# Altium schematic sheet SCH_WINGLET_ADSB.SchDoc: Winglet ADSB Receiver
size B; DrawnBy: HCAdam; Organization: Aerospace Village; DocumentNumber: WINGLET; Revision: A; SheetNumber: 8; SheetTotal: 10
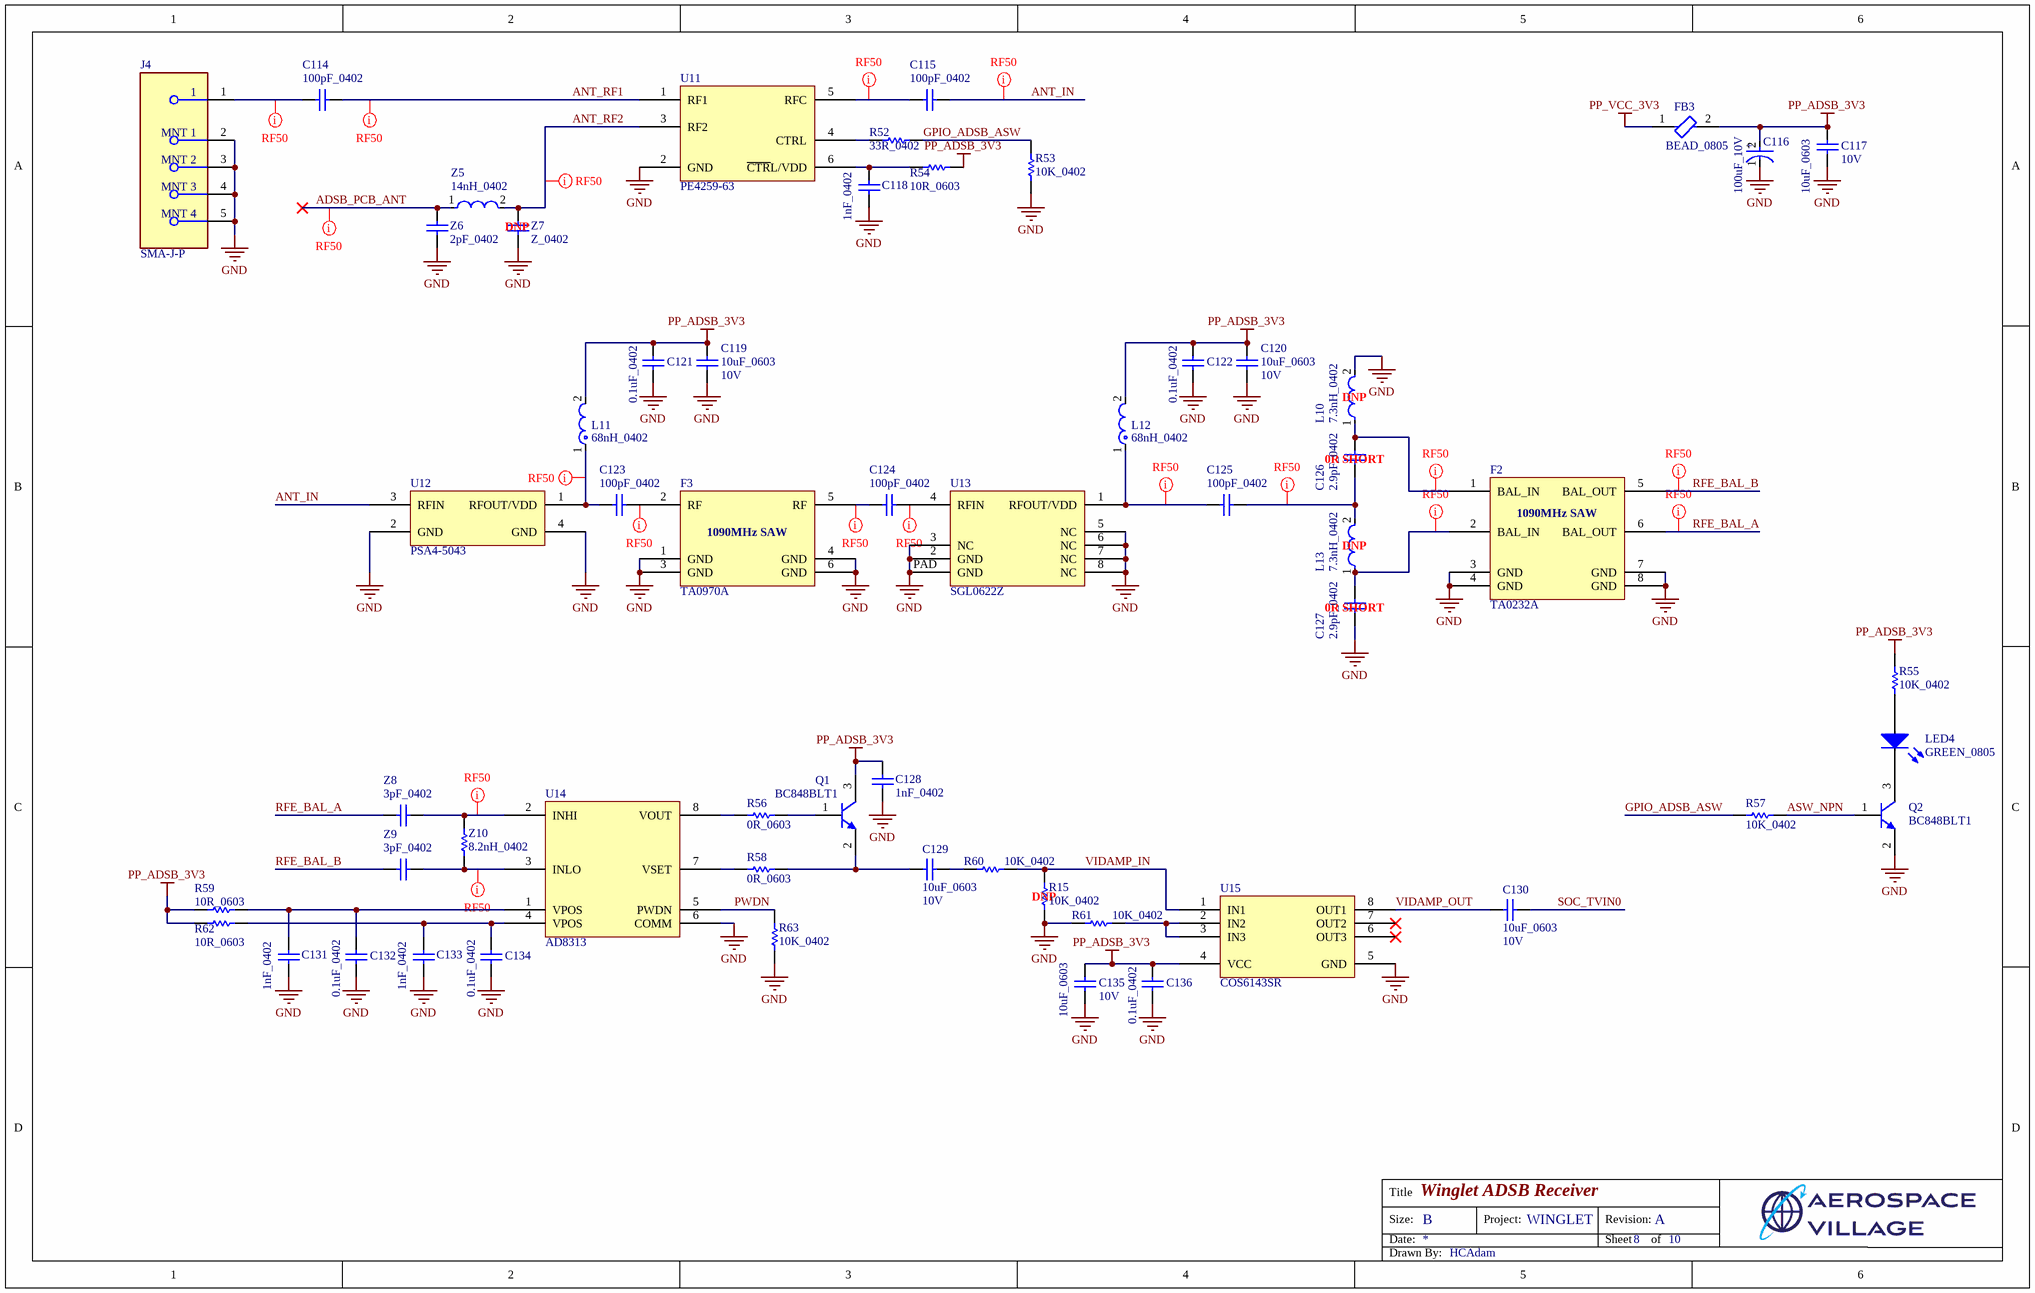
[diagram p0: SCH_WINGLET_ADSB.SchDoc]

## Parts
C114  100pF_0402  [CAPC1005X55X25NL05T10]
C115  100pF_0402  [CAPC1005X55X25NL05T10]
C116  100uF_10V  [FP-TAJB-MFG]
C117  10uF_0603  Voltage Rating: 10V  [CAPC1609X100X15NL20]
C118  1nF_0402  [CAPC1005X56X25NL10T15]
C119  10uF_0603  Voltage Rating: 10V  [CAPC1609X100X15NL20]
C120  10uF_0603  Voltage Rating: 10V  [CAPC1609X100X15NL20]
C121  0.1uF_0402  [CAPC1005X56X25NL10T15]
C122  0.1uF_0402  [CAPC1005X56X25NL10T15]
C123  100pF_0402  [CAPC1005X55X25NL05T10]
C124  100pF_0402  [CAPC1005X55X25NL05T10]
C125  100pF_0402  [CAPC1005X55X25NL05T10]
C126  2.9pF_0402  [CAPC1006X50X20NL10T10]
C127  2.9pF_0402  [CAPC1006X50X20NL10T10]
C128  1nF_0402  [CAPC1005X56X25NL10T15]
C129  10uF_0603  Voltage Rating: 10V  [CAPC1609X100X15NL20]
C130  10uF_0603  Voltage Rating: 10V  [CAPC1609X100X15NL20]
C131  1nF_0402  [CAPC1005X56X25NL10T15]
C132  0.1uF_0402  [CAPC1005X56X25NL10T15]
C133  1nF_0402  [CAPC1005X56X25NL10T15]
C134  0.1uF_0402  [CAPC1005X56X25NL10T15]
C135  10uF_0603  Voltage Rating: 10V  [CAPC1609X100X15NL20]
C136  0.1uF_0402  [CAPC1005X56X25NL10T15]
F2  TA0232A  [LCCS127P380X380X125-8N]
F3  TA0970A  [LCCS127P380X380X125-6N]
FB3  BEAD_0805  [FP-BLM21-0_2-t0_85-e0_5-IPC_B]
J4  SMA-J-P  [FP-SMA-J-P-H-ST-EM1-MFG]
L10  7.3nH_0402  [FP-LQW15AN_00-W0_6-0_1-MFG]
L11  68nH_0402  [FP-LQG15HH_02-MFG]
L12  68nH_0402  [FP-LQG15HH_02-MFG]
L13  7.3nH_0402  [FP-LQW15AN_00-W0_6-0_1-MFG]
LED4  GREEN_0805  [0805_A]
Q1  BC848BLT1  [ONSC-SOT-23-3-318-08_V]
Q2  BC848BLT1  [ONSC-SOT-23-3-318-08_V]
R15  10K_0402  [RESC1005X40X25NL05T05]
R52  33R_0402  [RESC1005X40X25NL05T05]
R53  10K_0402  [RESC1005X40X25NL05T05]
R54  10R_0603  [RESC1608X55X25NL10T15]
R55  10K_0402  [RESC1005X40X25NL05T05]
R56  0R_0603  [RESC1608X55X25LL10T15]
R57  10K_0402  [RESC1005X40X25NL05T05]
R58  0R_0603  [RESC1608X55X25LL10T15]
R59  10R_0603  [RESC1608X55X25NL10T15]
R60  10K_0402  [RESC1005X40X25NL05T05]
R61  10K_0402  [RESC1005X40X25NL05T05]
R62  10R_0603  [RESC1608X55X25NL10T15]
R63  10K_0402  [RESC1005X40X25NL05T05]
U11  PE4259-63  [SOT65P210X100-6N]
U12  PSA4-5043  [SOT343P210X110-4N-MMM]
U13  SGL0622Z  [SON50P200X90_HS-9N]
U14  AD8313  [TSOP65P490X110-8N-AD8313]
U15  COS6143SR  [SOP127P600X175-8N]
Z5  14nH_0402  [FP-LQW15AN_80-MFG]
Z6  2pF_0402  [CAPC1005X55X25NL05T10]
Z7  Z_0402  [CAPC1005X55X25NL05T10]
Z8  3pF_0402  [CAPC1006X50X20NL10T10]
Z9  3pF_0402  [CAPC1006X50X20NL10T10]
Z10  8.2nH_0402  [RESC1005X40X25NL05T05]

## Nets
GND: C116.1(C) C117.1 C118.1 C119.1 C120.1 C121.1 C122.1 C127.1 C128.1 C131.1 C132.1 C133.1 C134.1 C135.1 C136.1 F2.3(GND) F2.4(GND) F2.7(GND) F2.8(GND) F3.1(GND) F3.3(GND) F3.4(GND) F3.6(GND) J4.2(MNT_1) J4.3(MNT_2) J4.4(MNT_3) J4.5(MNT_4) L10.2 Q2.2(E) R15.1 R53.1 R61.1 R63.1 U11.2(GND) U12.2(GND) U12.4(GND) U13.2(GND) U13.3(NC) U13.5(NC) U13.6(NC) U13.7(NC) U13.8(NC) U13.PAD(GND) U14.6(COMM) U15.5(GND) Z6.1 Z7.1
PP_ADSB_3V3: C116.2(A) C117.2 C119.2 C120.2 C121.2 C122.2 C128.2 C135.2 C136.2 FB3.2 L11.2 L12.2 Q1.3(C) R54.2 R55.2 R59.1 R62.1 U15.4(VCC)
PP_VCC_3V3: FB3.1
ADSB_PCB_ANT: Z5.1 Z6.2
ANT_IN: C115.2 U12.3(RFIN)
ANT_RF1: C114.2 U11.1(RF1)
ANT_RF2: U11.3(RF2) Z5.2 Z7.2
ASW_NPN: Q2.1(B) R57.1
GPIO_ADSB_ASW: R52.2 R53.2 R57.2
PWDN: R63.2 U14.5(PWDN)
RFE_BAL_A: F2.6(BAL_OUT) Z8.2
RFE_BAL_B: F2.5(BAL_OUT) Z9.2
SOC_TVIN0: C130.1
VIDAMP_IN: R15.2 R60.2 U15.1(IN1)
VIDAMP_OUT: C130.2 U15.8(OUT1)
NetC114_1: C114.1 J4.1
NetC115_1: C115.1 U11.5(RFC)
NetC118_2: C118.2 R54.1 U11.6(~{CTR}L/VDD)
NetC123_1: C123.1 L11.1 U12.1(RFOUT/VDD)
NetC123_2: C123.2 F3.2(RF)
NetC124_1: C124.1 F3.5(RF)
NetC124_2: C124.2 U13.4(RFIN)
NetC125_1: C125.1 L12.1 U13.1(RFOUT/VDD)
NetC125_2: C125.2 C126.1 L13.2
NetC126_2: C126.2 F2.1(BAL_IN) L10.1
NetC127_2: C127.2 F2.2(BAL_IN) L13.1
NetC129_1: C129.1 R60.1
NetC129_2: C129.2 Q1.2(E) R58.1
NetC131_2: C131.2 C132.2 R59.2 U14.1(VPOS)
NetC133_2: C133.2 C134.2 R62.2 U14.4(VPOS)
NetLED4_1: LED4.1(K) Q2.3(C)
NetLED4_2: LED4.2(A) R55.1
NetQ1_1: Q1.1(B) R56.1
NetR52_1: R52.1 U11.4(CTRL)
NetR56_2: R56.2 U14.8(VOUT)
NetR58_2: R58.2 U14.7(VSET)
NetR61_2: R61.2 U15.2(IN2) U15.3(IN3)
NetU14_2: U14.2(INHI) Z8.1 Z10.2
NetU14_3: U14.3(INLO) Z9.1 Z10.1

Not connected (* = marked no-connect by the designer): U15 6(OUT3)* 7(OUT2)*

## Layout directives
net class RF_50Z: ADSB_PCB_ANT, ANT_IN, ANT_RF1, ANT_RF2, NetC114_1, NetC115_1, NetC123_1, NetC123_2, NetC124_1, NetC124_2, NetC125_1, NetC125_2, NetC126_2, NetC127_2, NetU14_2, NetU14_3, RFE_BAL_A, RFE_BAL_B

## Notes on the sheet
- Title
- Size:
- Date:
- B
- Project:
- Revision:
- Sheet
- of
- Drawn By:
- (in symbol CMP-04424-000366-1) +
- (in symbol TA0232A) 1090MHz SAW
- (in symbol TA0970A) 1090MHz SAW

## Library data of the parts
C114 C115 C123-C125 = CMP-2008-03915-1: GRM1555C1H101JA01D; Manufacturer: Murata; Part Number: GRM1555C1H101JA01D
C116 = CMP-04424-000366-1: 100uF 10V ±10% 1.7Ω SMD CASE-B (3528) Tantalum Capacitor; Voltage Rating (DC): 6.3V; ESR (Equivalent Series Resistance): 1.7R; Polarity: Polar; Leakage Current: 6.3uA; Height: 1.9mm; Depth: 2.8mm; Length: 3.5mm; Min Operating Temperature: -55°C; Width: 2.8mm; Series: TAJ; Lead Free: Lead Free; Case/Package: 1210; Voltage: 6.3V; Mount: Surface Mount; Tolerance: 10%; Capacitance: 100uF; Radiation Hardening: No; REACH SVHC: No SVHC; Voltage Rating: 6.3V; Case Code (Metric): 3528; Dissipation Factor: 10%; Packaging: Tape and Reel; Construction: Flat; Features: General Purpose; Max Operating Temperature: 125°C; RoHS Compliant: Yes; Package Quantity: 1; Dielectric Material: Tantalum; Termination: SMD/SMT; Case Code (Imperial): 1210; Height - Seated (Max): 0.083inch
C117 C119 C120 C129 C130 C135 = CMP-2006-00191-1: Part Number: TACL106M006XTA; Manufacturer: AVX Interconnect / Elco
C118 C128 C131 C133 = CMP-2008-02700-1: 04025C102KAT4A; Manufacturer: AVX Interconnect / Elco; Part Number: 04025C102KAT4A
C121 C122 C132 C134 C136 = CMP-2008-02743-1: 04026D104KAT2A; Manufacturer: AVX Interconnect / Elco; Voltage Rating: 6.3V; Part Number: 04026D104KAT2A
C126 C127 = CMP-2008-04791-1: 04023J2R9BBSTR; Manufacturer: AVX Interconnect / Elco; Part Number: 04023J2R9BBSTR; 0R SHORT: 0R SHORT
F2 = TA0232A: SAW Filter 1090MHz Balanced SMD 3.8x3.8mm
F3 = TA0970A: SAW Filter 1090MHz Unbalanced SMD 3.8x3.8mm
FB3 = CMP-0686-00717-3: Chip Ferrite Bead, 0805, 150Ω @ 100MHz, 0.09Ω, 25%, 1A; Number of Circuits: 1; Max Current Rating: 800mA; DC Resistance (DCR): 100mR; Shielding: Unshielded; DC Current: 200mA; Impedance: 150R; Contact Plating: Tin; Weight: 0.000194oz; Series: EMIFIL®, BLM21A; Core Material: Ferrite; Test Frequency: 100MHz; Case Code (Metric): 2012; Package Quantity: 4000; Lead Free: Lead Free; Max Operating Temperature: 125°C; Case Code (Imperial): 0805; Material: Ferrite; Min Operating Temperature: -55°C; Tolerance: 25%; Length: 2mm; DC Resistance-Max: 100mR; Width: 1.25mm; RoHS Compliant: Yes; Packaging: Tape and Reel; REACH SVHC: No SVHC; Depth: 1.45mm; Number of Pins: 2; Radiation Hardening: No; Current Rating: 800mA; Height: 0.85mm; Termination: SMD/SMT; Number of Lines: 1; Max DC Current: 200mA; Case/Package: 0805
J4 = CMP-02754-000006-1: CONN SMA JACK STR 50OHM EDGE MNT / SMA-J-P-H-ST-EM1; Dielectric Material: PTFE; Center Contact Plating: Gold; Max Frequency: 6GHz; Body Material: Brass; Voltage Rating: 335V; Impedance: 50R; Package Quantity: 1; Case/Package: SMA; Max Operating Temperature: 125°C; Fastening Type: Threaded; Orientation: Straight; Depth: 13.33mm; RoHS Compliant: Yes; Length: 6.35mm; Insulation Material: Polytetrafluoroethylene; Termination: Solder; Min Operating Temperature: -65°C; Housing Color: Gold; Contact Plating: Gold; Contact Material: Copper; Connector Type: SMA; Mount: Edge; Series: SMA; Packaging: Tray; Body Plating: Gold; Radiation Hardening: No
L10 L13 = CMP-06042-005854-1: Wire Wound RF Inductor 7.3nH ±3% 570mA 0.13Ω 0402 (1005) / LQW15AN7N3H00D; Self Resonant Frequency: 6GHz; DC Resistance (DCR): 130mR; Test Frequency: 100MHz; Shielding: Unshielded; Core Material: Non-Magnetic; Q Factor: 25; Width: 0.02inch; Min Operating Temperature: -55°C; Current Rating: 570mA; Depth: 0.7mm; Weight: 2.8E-05oz; Termination: SMD/SMT; Case Code (Imperial): 0402; Max Operating Temperature: 125°C; Mount: Surface Mount; Case Code (Metric): 1005; Military Standard: Not; Case/Package: 0402; Radiation Hardening: No; Package Quantity: 10000; Height - Seated (Max): 0.024inch; Tolerance: 3%; Max DC Current: 570mA; Inductance: 7.3nH; Packaging: Tape and Reel; DC Current: 570mA; Resistor Type: Wirewound; Height: 0.5mm; Length: 1mm; DNP: DNP
L11 L12 = CMP-06042-006384-1: Multilayer type RF Inductor 68nH ±5% 0.92Ω 250mA 0402 / LQG15HS68NJ02D; Current Rating: 180mA; Shielding: Unshielded; Core Material: Air; Self Resonant Frequency: 800MHz; DC Resistance (DCR): 920mR; Test Frequency: 100MHz; Q Factor: 8; Length: 1mm; Max Operating Temperature: 125°C; Width: 0.02inch; Case Code (Metric): 1005; Package Quantity: 1; Termination: SMD/SMT; Tolerance: 5%; Packaging: Tape and Reel; Radiation Hardening: No; Inductance: 68nH; Case Code (Imperial): 0402; Lead Free: Lead Free; Mount: Surface Mount; Max DC Current: 180mA; Case/Package: 0402; Height: 0.5mm; DC Current: 180mA; Military Standard: Not; Min Operating Temperature: -55°C; Height - Seated (Max): 0.022inch; Depth: 0.55mm
LED4 = CMP-1426-00007-1: SMD mono-color Chip LED, WL-SMCW, Green / 150080GS75000; Manufacturer: Wuerth Elektronik; PackageReference: 0805_A; Color: Green; PartNumber: 150080GS75000; ComponentLink2URL: http://katalog.we-online.com/led/datasheet/150080GS75000.pdf; ComponentLink1URL: http://www.we-online.com; ComponentLink1Description: Manufacturer URL; ComponentLink2Description: Datasheet
Q1 Q2 = CMP-1048-00685-1: General Purpose Transistor, NPN Silicon, 3-Pin SOT-23, Tape and Reel; Manufacturer: On Semiconductor; fT Min (MHz): 100; IC Continuous (A): 0.1; ComponentLink1URL: http://www.onsemi.com/; PackageDescription: 3-Pin Small Outline Transistor, Body 2.92 x 1.3 mm, Pitch 0.95 mm; PackageReference: SOT-23-3-318-08; PackageVersion: Rev. AP, 11/2009; Polarity: NPN; ComponentLink2URL: http://www.onsemi.cn/pub_link/Collateral/BC846ALT1-D.PDF; ComponentLink3Description: Package Specification; Packing: Tape and Reel; DatasheetVersion: Rev. 11; ComponentLink2Description: Datasheet; ComponentLink1Description: Manufacturer URL; PartNumber: BC848BLT1; RoHS: FALSE; ComponentLink3URL: http://www.onsemi.cn/pub_link/Collateral/318-08.PDF; Mounting Technology: Surface Mount
R15 R53 R55 R57 R60 R61 R63 Z10 = CMP-2000-07588-1: Chip Resistor, 10 KOhm, +/- 1%, 0.1 W, -55 to 155 degC, 0402 (1005 Metric), RoHS, Tape and Reel / ERJ2RKF1002X; Manufacturer: Panasonic; Power Rating: 100mW; Voltage Rating: 50V; Resistance: 10KOhm; Case\/Package: 0402; Temperature Coefficient: 100ppm\/degreesC; RoHSCompliant: True; Lead Free: LeadFree; Package Quantity: 1; Contact Plating: Tin; Length: 1mm; Radiation Hardening: No; REACH SVHC: NoSVHC; Max Operating Temperature: 155degC; Depth: 0.5mm; Case Code (Imperial): 0402; Military Standard: Not; Package Description: 2-Pin Surface Mount Device, Body 1 x 0.5 mm; Termination: SMD/SMT; Case Code (Metric): 1005; Height: 0.35mm; Packaging: TapeandReel; Voltage Rating (DC): 50V; Package Reference: 402; Number of Pins: 2; Tolerance: 1%; Mounting Technology: SurfaceMount; Width: 0.02inch; Mount: SurfaceMount; Datasheet URL: https://industrial.panasonic.com/cdbs/www-data/pdf/RDA0000/AOA0000C304.pdf; Composition: ThickFilm; Datasheet Version: 02/2017; Manufacturer URL: http://www.panasonic.com/; Max Power Dissipation: 100mW; Number of Terminations: 2; Min Operating Temperature: -55degC
  R15: DNP: DNP
R52 = CMP-2002-01146-1: ERJ2RKF33R0X; Manufacturer: Panasonic; Part Number: ERJ2RKF33R0X
R54 R59 R62 = CMP-1659-00008-4: Chip Resistor, 10 Ohm, +/- 1%, 0.1 W, -55 to 155 degC, 0603 (1608 Metric), RoHS, Tape and Reel / RC0603FR-0710RL; Manufacturer: Yageo; Voltage Rating: 50 V; PackageReference: 0603; ComponentLink3Description: Package Specification; Packaging: Tape and Reel; Max Operating Temperature: 155 degC; ComponentLink3URL: http://www.farnell.com/datasheets/443971.pdf; PackageDescription: 2-Pin Surface Mount Device, Body 1.6 x 0.8 mm; ComponentLink1URL: http://www.yageo.com/; Pins: 2; REACH SVHC: No SVHC; RoHSCompliant: true; ComponentLink2URL: http://www.yageo.com/documents/recent/PYu-RC_Group_51_RoHS_L_04.pdf; DatasheetVersion: Rev. 4, 02/2016; Mount: Surface Mount; Package Quantity: 200; Min Operating Temperature: -55 degC; Height: 0.45 mm; Mounting Technology: Surface Mount; ComponentLink1Description: Manufacturer URL; ComponentLink2Description: Datasheet; Length: 1.6 mm
R56 R58 = CMP-2000-04300-1: RC0603JR-100RL; Manufacturer: Yageo; Part Number: RC0603JR-100RL
U11 = PE4259: SPDT High Power UltraCMOS® / 10 MHz–3.0 GHz RF Switch
U12 = PSA4-5043: 50Ω 0.05 to 4 GHz Ultra-Low Noise MMIC Amplifier
U13 = SGL0622Z: 5 MHz to 4000 MHz, Low-Noise SiGe HBT MMIC Amplifier
U14 = AD8313: 0.1 GHz to 2.5 GHz 70 dB Logarithmic Detector/Controller
U15 = COS6143SR: Triple, 6th Order, Standard Definition Video Filter Driver
Z5 = CMP-06042-012069-1: Wire Wound RF Inductor 14nH ±2% 1150mA 0.111Ω 0402 (1005) / LQW15AN14NG80D; Max DC Current: 1.15A; Shielding: Unshielded; Self Resonant Frequency: 5.2GHz; Core Material: Non-Magnetic; Test Frequency: 100MHz; Q Factor: 31; DC Resistance (DCR): 111mR; Min Operating Temperature: -55°C; Current Rating: 1.15A; Inductance: 14nH; Width: 0.5mm; Package Quantity: 1; Lead Free: Lead Free; Resistor Type: Wirewound; Mount: Surface Mount; Case Code (Metric): 1005; Case Code (Imperial): 0402; Length: 0.039inch; Tolerance: 2%; Max Operating Temperature: 125°C; Termination: SMD/SMT; Height - Seated (Max): 0.024inch; Packaging: Tape and Reel; Case/Package: 0402; Height: 0.5mm
Z6 Z7 = CMP-2008-04315-1: GRM1555C1H2R0CA01D; Manufacturer: Murata; Part Number: GRM1555C1H2R0CA01D
  Z7: DNP: DNP
Z8 Z9 = CMP-2008-04829-1: Manufacturer: AVX Interconnect / Elco; Part Number: 0402YJ100FBSTR